# EAGLE design Arduino_like (EAGLE 6.1)
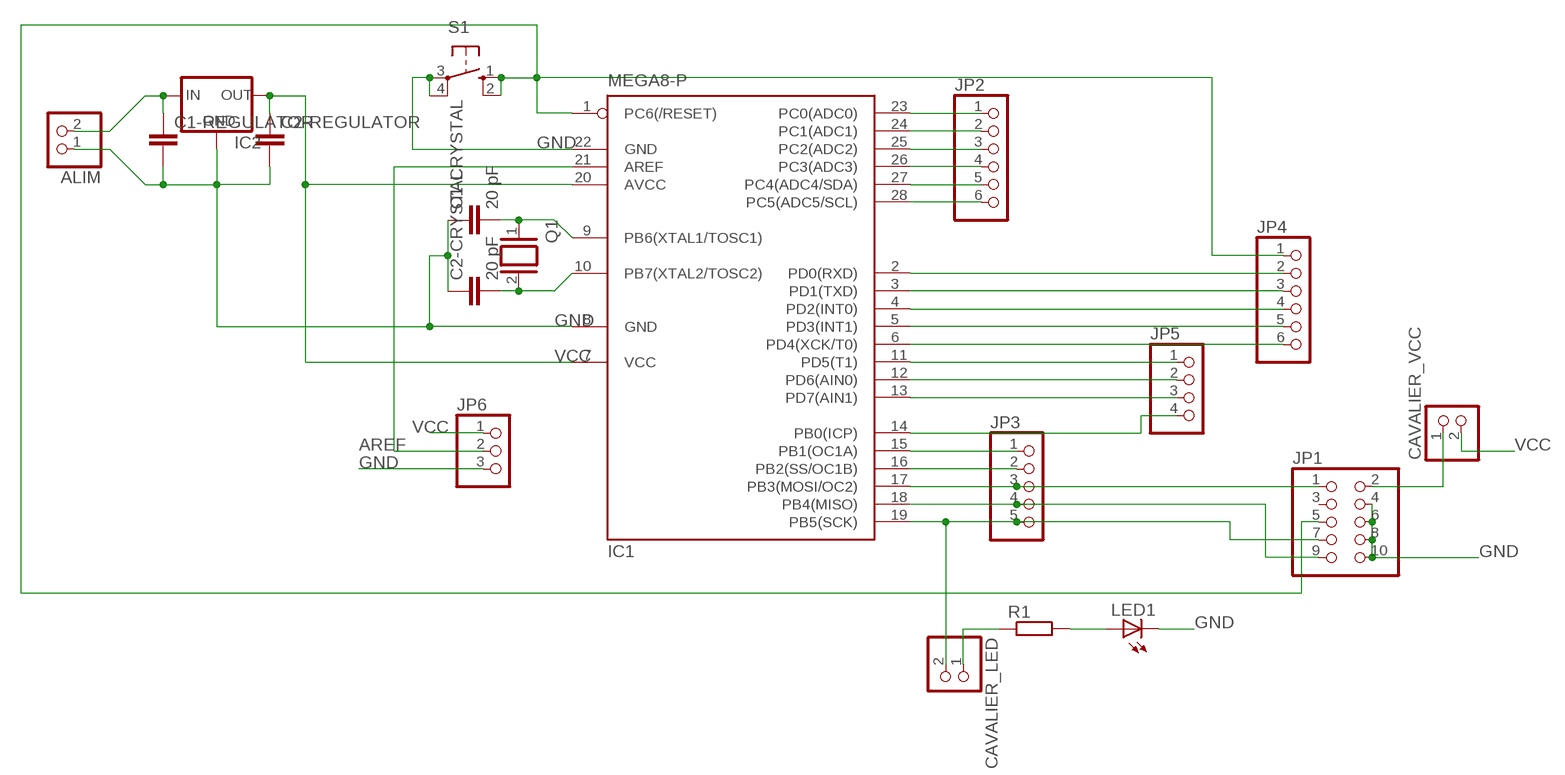
[diagram p0: schematic, sheet 1]

## Parts
ALIM  PINHD-1X2  [1X02]
C1-CRYSTAL  20 pF  C5/5  [C5B5]
C1-REGULATOR  C5/3.5  [C5B3.5]
C2-CRYSTAL  20 pF  C5/5  [C5B5]
C2-REGULATOR  C5/3.5  [C5B3.5]
CAVALIER_LED  PINHD-1X2  [1X02]
CAVALIER_VCC  PINHD-1X2  [1X02]
IC1  MEGA8-P  [DIL28-3]
IC2  78XXS  [78XXS]
JP1  PINHD-2X5  [2X05]
JP2  PINHD-1X6  [1X06]
JP3  PINHD-1X5  [1X05]
JP4  PINHD-1X6  [1X06]
JP5  PINHD-1X4  [1X04]
JP6  PINHD-1X3  [1X03]
LED1  LED3MM  [LED3MM]
Q1  XTAL/S  [QS]
R1  R-EU_0204/7  [0204/7]
S1  10-XX  [B3F-10XX]

## Nets
AREF: IC1.21(AREF) JP6.2
GND: ALIM.1 C1-CRYSTAL.1 C1-REGULATOR.2 C2-CRYSTAL.1 C2-REGULATOR.2 IC1.8(GND) IC1.22(GND) IC2.GND JP1.4 JP1.6 JP1.8 JP1.10 JP6.3 LED1.K(C) S1.3(P) S1.4(P1)
N$1: C1-CRYSTAL.2 IC1.9(PB6(XTAL1/TOSC1)) Q1.1
N$2: C2-CRYSTAL.2 IC1.10(PB7(XTAL2/TOSC2)) Q1.2
N$3: IC1.17(PB3(MOSI/OC2)) JP1.1 JP3.3
N$4: IC1.1(PC6(/RESET)) JP1.5 JP4.1 S1.1(S) S1.2(S1)
N$5: CAVALIER_LED.2 IC1.19(PB5(SCK)) JP1.7 JP3.5
N$6: ALIM.2 C1-REGULATOR.1 IC2.IN
N$7: IC1.18(PB4(MISO)) JP1.9 JP3.4
N$8: IC1.23(PC0(ADC0)) JP2.1
N$9: IC1.24(PC1(ADC1)) JP2.2
N$10: IC1.25(PC2(ADC2)) JP2.3
N$11: IC1.26(PC3(ADC3)) JP2.4
N$12: IC1.27(PC4(ADC4/SDA)) JP2.5
N$13: IC1.28(PC5(ADC5/SCL)) JP2.6
N$14: IC1.2(PD0(RXD)) JP4.2
N$15: CAVALIER_VCC.1 JP1.2
N$16: IC1.3(PD1(TXD)) JP4.3
N$17: IC1.4(PD2(INT0)) JP4.4
N$18: IC1.5(PD3(INT1)) JP4.5
N$19: IC1.6(PD4(XCK/T0)) JP4.6
N$20: IC1.11(PD5(T1)) JP5.1
N$21: IC1.12(PD6(AIN0)) JP5.2
N$22: IC1.13(PD7(AIN1)) JP5.3
N$23: IC1.14(PB0(ICP)) JP5.4
N$24: IC1.15(PB1(OC1A)) JP3.1
N$25: IC1.16(PB2(SS/OC1B)) JP3.2
N$26: CAVALIER_LED.1 R1.1
N$27: LED1.A R1.2
VCC: C2-REGULATOR.1 CAVALIER_VCC.2 IC1.7(VCC) IC1.20(AVCC) IC2.OUT JP6.1
Unconnected: JP1.3

## Library data of the parts
ALIM CAVALIER_LED CAVALIER_VCC = pinhead:PINHD-1X2: PIN HEADER
C1-CRYSTAL C1-REGULATOR C2-CRYSTAL C2-REGULATOR = capacitor-wima:C: CAPACITOR naming: grid - package width
IC1 = atmel:MEGA8-P: MICROCONTROLLER 8 Kbytes FLASH, 1 kbytes SRAM, 512 bytes EEPROM, USART, 4-channel 10 bit ADC, 2-channel 8 bit ADC Pin compatible with Atmega48, ATMega88, ATMega168 Source: avr.lbr; OC_FARNELL: unknown; OC_NEWARK: unknown
IC2 = v-reg:78XXS: VOLTAGE REGULATOR
JP1 = pinhead:PINHD-2X5: PIN HEADER
JP2 JP4 = pinhead:PINHD-1X6: PIN HEADER
JP3 = pinhead:PINHD-1X5: PIN HEADER
JP5 = pinhead:PINHD-1X4: PIN HEADER
JP6 = pinhead:PINHD-1X3: PIN HEADER
LED1 = led:LED: LED OSRAM: - CHIPLED LG R971, LG N971, LY N971, LG Q971, LY Q971, LO R971, LY R971 LH N974, LH R974 LS Q976, LO Q976, LY Q976 LO Q996 - Hyper CHIPLED LW Q18S LB Q993, LB Q99A, LB R99A - SideLED LS A670, LO A670, LY A670, LG A670, LP A670 LB A673, LV A673, LT A673, LW A673 LH A674 LY A675 LS A676, LA A676, LO A676, LY A676, LW A676 LS A679, LY A679, LG A679 - Hyper Micro SIDELED® LS Y876, LA Y876, LO Y876, LY Y876 LT Y87S - SmartLED LW L88C, LW L88S LB L89C, LB L89S, LG L890 LS L89K, LO L89K, LY L89K LS L896, LA L896, LO L896, LY L896 - TOPLED LS T670, LO T670, LY T670, LG T670, LP T670 LSG T670, LSP T670, LSY T670, LOP T670, LYG T670 LG T671, LOG T671, LSG T671 LB T673, LV T673, LT T673, LW T673 LH T674 LS T676, LA T676, LO T676, LY T676, LB T676, LH T676, LSB T676, LW T676 LB T67C, LV T67C, LT T67C, LS T67K, LO T67K, LY T67K, LW E67C LS E67B, LA E67B, LO E67B, LY E67B, LB E67C, LV E67C, LT E67C LW T67C LS T679, LY T679, LG T679 LS T770, LO T770, LY T770, LG T770, LP T770 LB T773, LV T773, LT T773, LW T773 LH T774 LS E675, LA E675, LY E675, LS T675 LS T776, LA T776, LO T776, LY T776, LB T776 LHGB T686 LT T68C, LB T68C - Hyper Mini TOPLED® LB M676 - Mini TOPLED Santana® LG M470 LS M47K, LO M47K, LY M47K Source: http://www.osram.convergy.de LUXEON: - LUMILED® LXK2-PW12-R00, LXK2-PW12-S00, LXK2-PW14-U00, LXK2-PW14-V00 LXK2-PM12-R00, LXK2-PM12-S00, LXK2-PM14-U00 LXK2-PE12-Q00, LXK2-PE12-R00, LXK2-PE12-S00, LXK2-PE14-T00, LXK2-PE14-U00 LXK2-PB12-K00, LXK2-PB12-L00, LXK2-PB12-M00, LXK2-PB14-N00, LXK2-PB14-P00, LXK2-PB14-Q00 LXK2-PR12-L00, LXK2-PR12-M00, LXK2-PR14-Q00, LXK2-PR14-R00 LXK2-PD12-Q00, LXK2-PD12-R00, LXK2-PD12-S00 LXK2-PH12-R00, LXK2-PH12-S00 LXK2-PL12-P00, LXK2-PL12-Q00, LXK2-PL12-R00 Source: www.luxeon.com KINGBRIGHT: KA-3528ASYC Source: www.kingbright.com
Q1 = special:XTAL/S: CRYSTAL
R1 = rcl:R-EU_: RESISTOR, European symbol
S1 = switch-omron:10-XX: OMRON SWITCH; MPN: B3F-1000; OC_FARNELL: 176432; OC_NEWARK: 36M3542

## Board
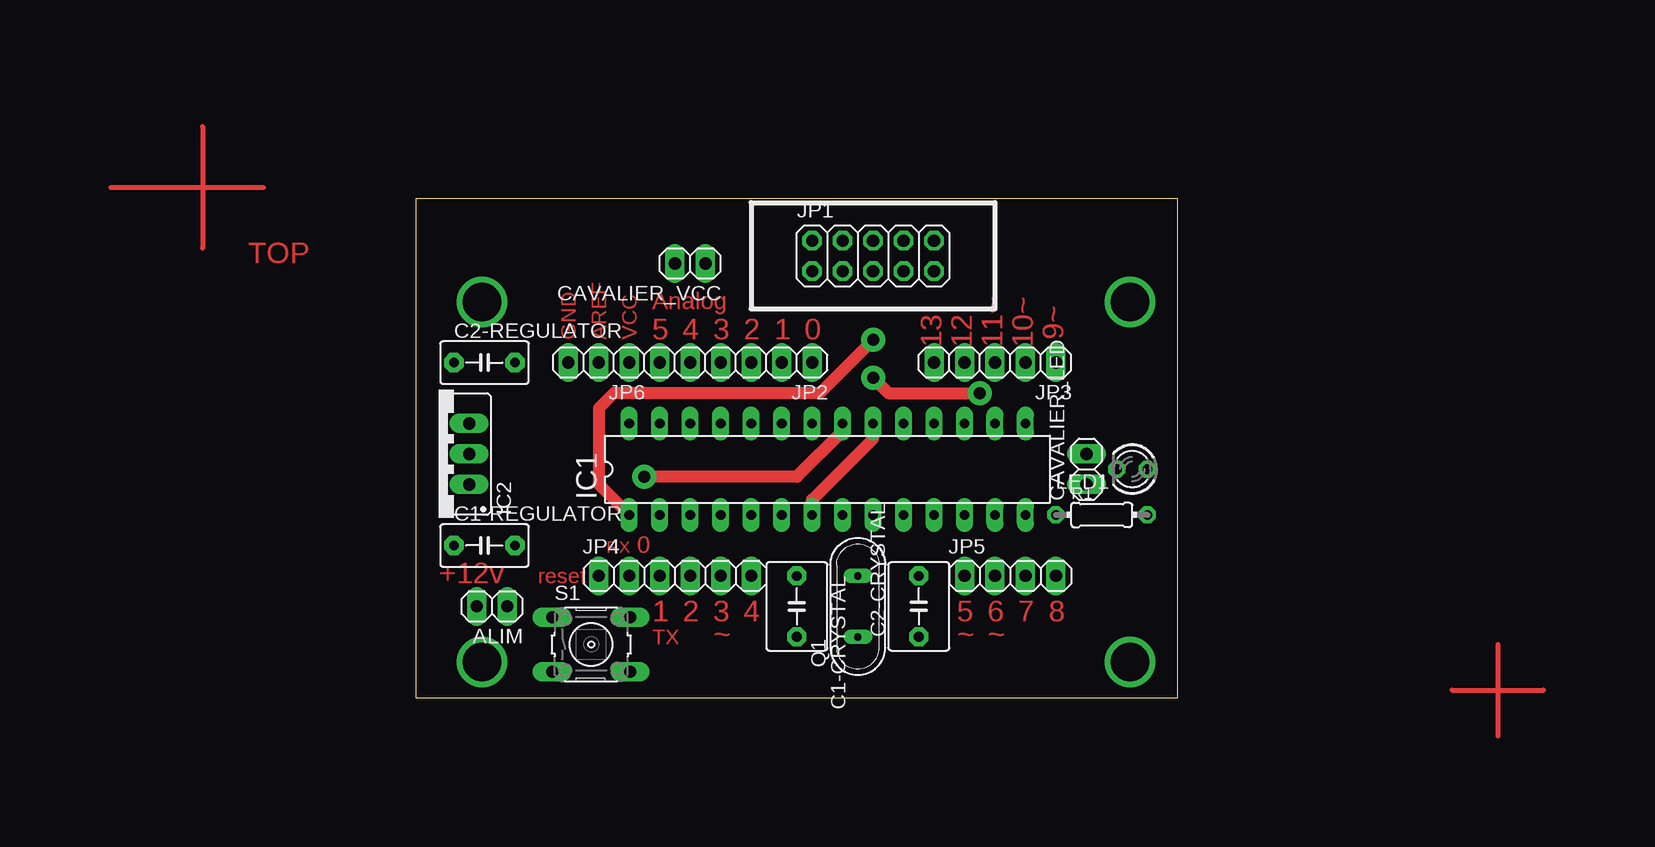
[diagram p1: board, top side]
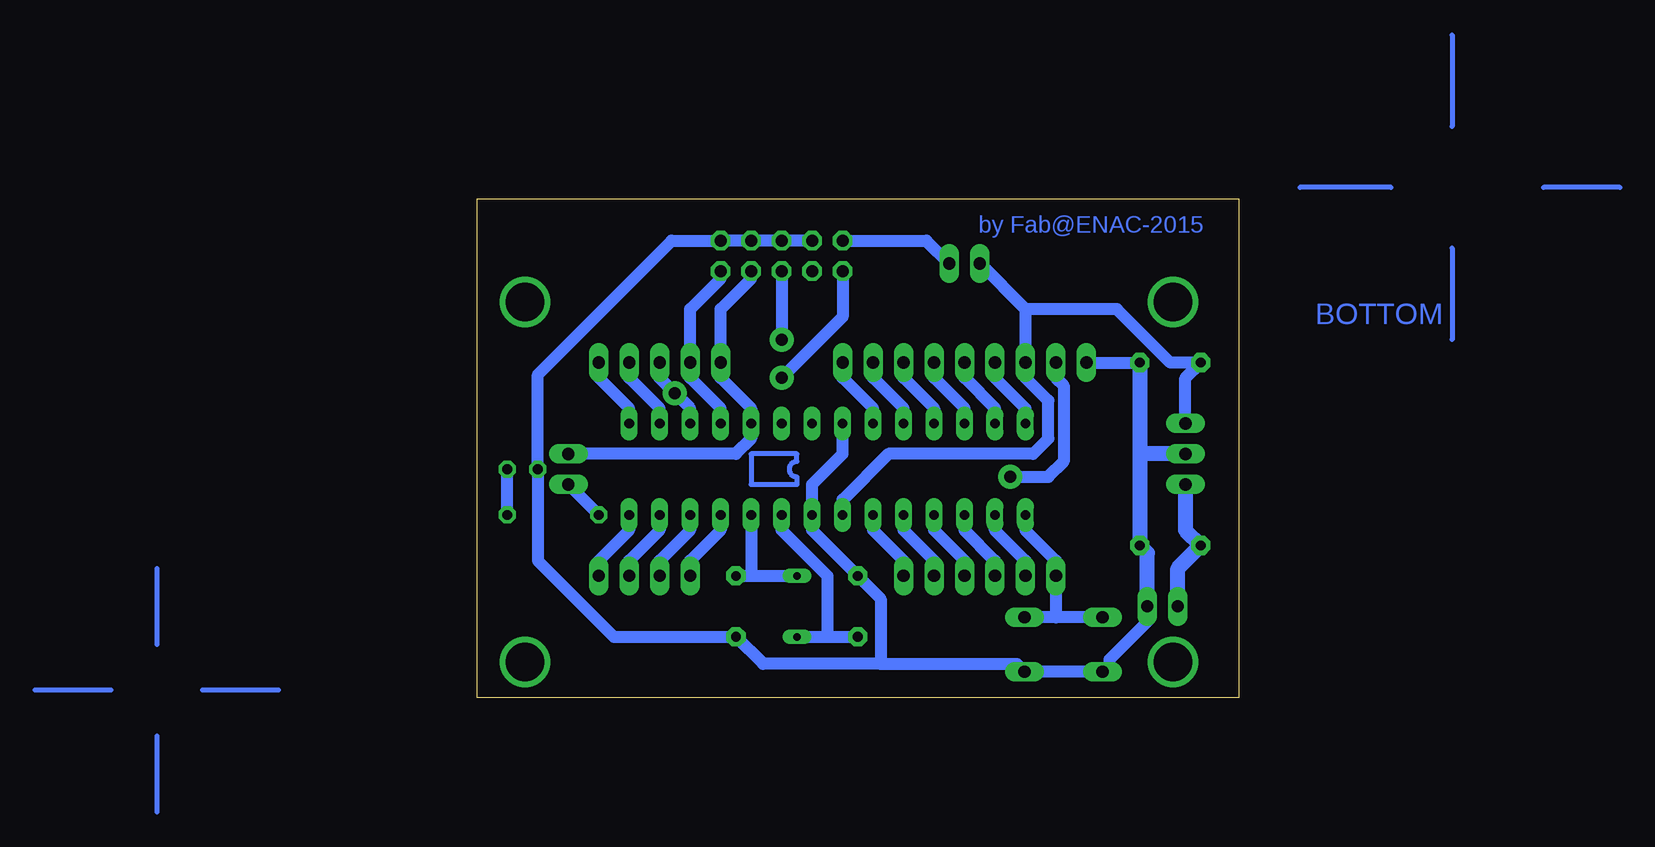
[diagram p2: board, bottom side, seen from below]

Size 63.48 x 41.58 mm. Coordinates in mm from the lower left corner, seen from the top.
Outline: 0,0 63.48,0 63.48,41.58 0,41.58 0,0
Copper layers (1*16): Top 0.035mm / dielectric 1.5mm / Bottom 0.035mm
Design rules: minimum track width 10mil, minimum drill 24mil, track to track 8mil, track to pad 8mil, pad to pad 8mil, via to via 8mil, smd to smd 8mil, copper to edge 40mil, drill to drill 8mil, minimum pad ring 12mil, minimum via ring 12mil, stop-mask expansion 4mil, vias tented up to drill 0mil, thermal gap 10mil

### Footprints (pad centres in the part's own frame; a part is rotated, then mirrored left to right if it is on the bottom)
1X02 = drill 1.016 long: 1 -1.27,0; 2 1.27,0
C5B5 = drill 0.813 pad 1.6 octagon: 1 -2.54,0; 2 2.54,0
C5B3.5 = drill 0.813 pad 1.6 octagon: 1 -2.54,0; 2 2.54,0
DIL28-3 = drill 0.813 long: 1 -16.51,-3.81; 2 -13.97,-3.81; 3 -11.43,-3.81; 4 -8.89,-3.81; 5 -6.35,-3.81; 6 -3.81,-3.81; 7 -1.27,-3.81; 8 1.27,-3.81; 9 3.81,-3.81; 10 6.35,-3.81; 11 8.89,-3.81; 12 11.43,-3.81; 13 13.97,-3.81; 14 16.51,-3.81; 15 16.51,3.81; 16 13.97,3.81; 17 11.43,3.81; 18 8.89,3.81; 19 6.35,3.81; 20 3.81,3.81; 21 1.27,3.81; 22 -1.27,3.81; 23 -3.81,3.81; 24 -6.35,3.81; 25 -8.89,3.81; 26 -11.43,3.81; 27 -13.97,3.81; 28 -16.51,3.81
78XXS = drill 1.016 long: GND 0,-2.54; IN -2.54,-2.54; OUT 2.54,-2.54
2X05 = drill 1.016 octagon: 1 -5.08,-1.27; 2 -5.08,1.27; 3 -2.54,-1.27; 4 -2.54,1.27; 5 0,-1.27; 6 0,1.27; 7 2.54,-1.27; 8 2.54,1.27; 9 5.08,-1.27; 10 5.08,1.27
1X06 = drill 1.016 long: 1 -6.35,0; 2 -3.81,0; 3 -1.27,0; 4 1.27,0; 5 3.81,0; 6 6.35,0
1X05 = drill 1.016 long: 1 -5.08,0; 2 -2.54,0; 3 0,0; 4 2.54,0; 5 5.08,0
1X04 = drill 1.016 long: 1 -3.81,0; 2 -1.27,0; 3 1.27,0; 4 3.81,0
1X03 = drill 1.016 long: 1 -2.54,0; 2 0,0; 3 2.54,0
LED3MM = drill 0.813 octagon: A -1.27,0; K 1.27,0
QS = drill 0.61 long: 1 -2.54,0; 2 2.54,0
0204/7 = drill 0.813 octagon: 1 -3.81,0; 2 3.81,0
B3F-10XX = drill 1.016 long: 1 -3.251,2.261; 2 3.251,2.261; 3 -3.251,-2.261; 4 3.251,-2.261

### Placement (x,y rotation side)
ALIM  6.35,7.62 180 top
C1-CRYSTAL  31.75,7.62 270 top
C1-REGULATOR  5.71,12.7 0 top
C2-CRYSTAL  41.91,7.62 90 top
C2-REGULATOR  5.71,27.94 0 top
CAVALIER_LED  55.88,19.05 90 top
CAVALIER_VCC  22.86,36.2 180 top
IC1  34.29,19.05 0 top
IC2  1.91,20.32 90 top
JP1  38.1,36.83 0 top
JP2  26.67,27.94 180 top
JP3  48.26,27.94 180 top
JP4  21.59,10.16 0 top
JP5  49.53,10.16 0 top
JP6  15.24,27.94 180 top
LED1  59.69,19.05 180 top
Q1  36.83,7.62 90 top
R1  57.15,15.24 0 top
S1  14.61,4.45 0 top

### Tracks (layer width: path | path; a pad name or v marks a point on that pad's centre or on a via)
AREF  (via drill 1)
  Top 1.016: IC1.21 35.56,22.23 31.75,18.41 v19.05,18.41
  Bottom 1.016: v19.05,18.41 15.88,18.41 14.61,19.68 14.61,26.04 15.24,26.67 JP6.2
GND
  Bottom 1.016: IC1.22 33.02,20.32 35.56,17.78 IC1.8 35.56,13.97 C1-CRYSTAL.1 29.84,8.26 29.84,2.82 | JP1.4 JP1.6 JP1.8 JP1.10 47.26,38.1 58.42,26.94 LED1.K 58.42,11.43 52.07,5.08 C2-CRYSTAL.1 39.65,2.82 29.84,2.82 | S1.3 S1.4 18.49,2.82 29.84,2.82 | JP6.3 C2-REGULATOR.2 | 7.62,6.58 7.62,6.35 10.79,3.17 10.79,2.12 10.58,2.12
  Bottom 1.27: C2-REGULATOR.2 8.26,20.32 | 8.26,20.32 C1-REGULATOR.2 7.62,12.06 ALIM.1 7.62,6.58 | IC2.GND 8.26,20.32 | S1.3 10.58,2.12
N$1
  Bottom 1.016: IC1.9 38.1,13.97 34.29,10.16 34.29,5.08 | Q1.1 34.29,5.08 | 34.29,5.08 C1-CRYSTAL.2
N$2
  Bottom 1.016: C2-CRYSTAL.2 40.64,10.16 | 40.64,10.16 Q1.2 | IC1.10 40.64,10.16
N$3  (via drill 1)
  Top 1.016: v38.1,26.67 39.37,25.4 v46.99,25.4
  Bottom 1.016: JP1.1 33.02,31.75 v38.1,26.67 | IC1.17 45.72,24.13 v46.99,25.4 48.26,26.67 JP3.3
N$4  (via drill 1)
  Top 1.016: v38.1,29.84 33.66,25.4 16.51,25.4 15.24,24.13 15.24,17.78 IC1.1
  Bottom 1.016: JP1.5 v38.1,29.84 | S1.1 15.24,6.71 | 15.24,6.71 S1.2 | IC1.1 17.78,13.97 15.24,11.43 JP4.1 15.24,6.71
N$5
  Bottom 1.016: JP1.7 40.64,34.92 43.18,32.38 JP3.5 43.18,26.67 40.64,24.13 IC1.19 40.64,21.59 41.91,20.32 CAVALIER_LED.2
N$6
  Bottom 1.27: IC2.IN 4.45,13.97 C1-REGULATOR.1 5.08,10.79 ALIM.2
N$7
  Bottom 1.016: IC1.18 43.18,24.13 45.72,26.67 JP3.4 45.72,32.38 43.18,34.92 JP1.9
N$8
  Bottom 1.016: IC1.23 30.48,24.13 33.02,26.67 JP2.1
N$9
  Bottom 1.016: IC1.24 27.94,24.13 30.48,26.67 JP2.2
N$10
  Bottom 1.016: JP2.3 27.94,26.67 25.4,24.13 IC1.25
N$11
  Bottom 1.016: IC1.26 22.86,24.13 25.4,26.67 JP2.4
N$12
  Bottom 1.016: JP2.5 22.86,26.67 20.32,24.13 IC1.27
N$13
  Bottom 1.016: JP2.6 20.32,26.67 17.78,24.13 IC1.28
N$14
  Bottom 1.016: IC1.2 20.32,13.97 17.78,11.43 JP4.2
N$15
  Bottom 1.016: JP1.2 26.04,38.1 CAVALIER_VCC.1
N$16
  Bottom 1.016: IC1.3 22.86,13.97 20.32,11.43 JP4.3
N$17
  Bottom 1.016: IC1.4 25.4,13.97 22.86,11.43 JP4.4
N$18
  Bottom 1.016: IC1.5 27.94,13.97 25.4,11.43 JP4.5
N$19
  Bottom 1.016: IC1.6 30.48,13.97 27.94,11.43 JP4.6
N$20
  Bottom 1.016: IC1.11 43.18,13.97 45.72,11.43 JP5.1
N$21
  Bottom 1.016: IC1.12 45.72,13.97 48.26,11.43 JP5.2
N$22
  Bottom 1.016: IC1.13 48.26,13.97 50.8,11.43 JP5.3
N$23
  Bottom 1.016: IC1.14 50.8,13.97 53.34,11.43 JP5.4
N$24
  Bottom 1.016: IC1.15 50.8,24.13 53.34,26.67 JP3.1
N$25
  Bottom 1.016: IC1.16 48.26,24.13 50.8,26.67 JP3.2
N$26
  Bottom 1.016: CAVALIER_LED.1 R1.1
N$27
  Bottom 1.016: R1.2 LED1.A
N$28
  Bottom 0.406: 36.83,19.68 arc-180 36.83,18.41 36.83,17.78 40.64,17.78 40.64,20.32 36.83,20.32 36.83,19.68
N$29  (via drill 3.2)
  other vias: 5.5,3
N$30
  Bottom 0.406: -17.78,55.24 -17.78,47.62
N$31
  Top 0.406: -17.78,47.62 -17.78,37.47
N$32
  Bottom 0.406: -17.78,37.47 -17.78,29.84
N$33
  Bottom 0.406: -31.75,42.55 -25.4,42.55
N$34
  Top 0.406: -25.4,42.55 -12.7,42.55
N$35
  Bottom 0.406: -12.7,42.55 -5.08,42.55
N$36
  Bottom 0.406: 90.17,10.79 90.17,4.45
N$37
  Top 0.406: 90.17,4.45 90.17,-3.17
N$38
  Bottom 0.406: 90.17,-3.17 90.17,-9.53
N$39
  Bottom 0.406: 80.01,0.64 86.36,0.64
N$40
  Top 0.406: 86.36,0.64 93.98,0.64
N$41
  Bottom 0.406: 93.98,0.64 100.33,0.64
N$42  (via drill 3.2)
  other vias: 59.5,3
N$43  (via drill 3.2)
  other vias: 59.5,33
N$44  (via drill 3.2)
  other vias: 5.5,33
VCC
  Top 1.016: IC1.7 33.02,16.51 38.1,21.59 IC1.20
  Bottom 1.016: IC1.7 33.02,16.51 29.21,20.32 17.14,20.32 15.88,21.59 15.88,24.77 17.78,26.67 JP6.1 17.78,32.38 | CAVALIER_VCC.2 17.78,32.38 | 17.78,32.38 10.16,32.38 5.71,27.94 C2-REGULATOR.1 4.45,26.67 IC2.OUT

### Text on the board
Top: TOP | Analog | GND | AREF | VCC | 5 | 4 | 3 | 2 | 1 | 0 | 9~ | 13 | 12 | 11~ | 10~ | RX | 0 | +12v | reset | 1 | 2 | 3 | 4 | 5 | 6 | 7 | 8 | TX | ~ | ~ | ~
Bottom: by Fab@ENAC-2015 | BOTTOM